# EAGLE design esp8266Remote (EAGLE 9.5.2)
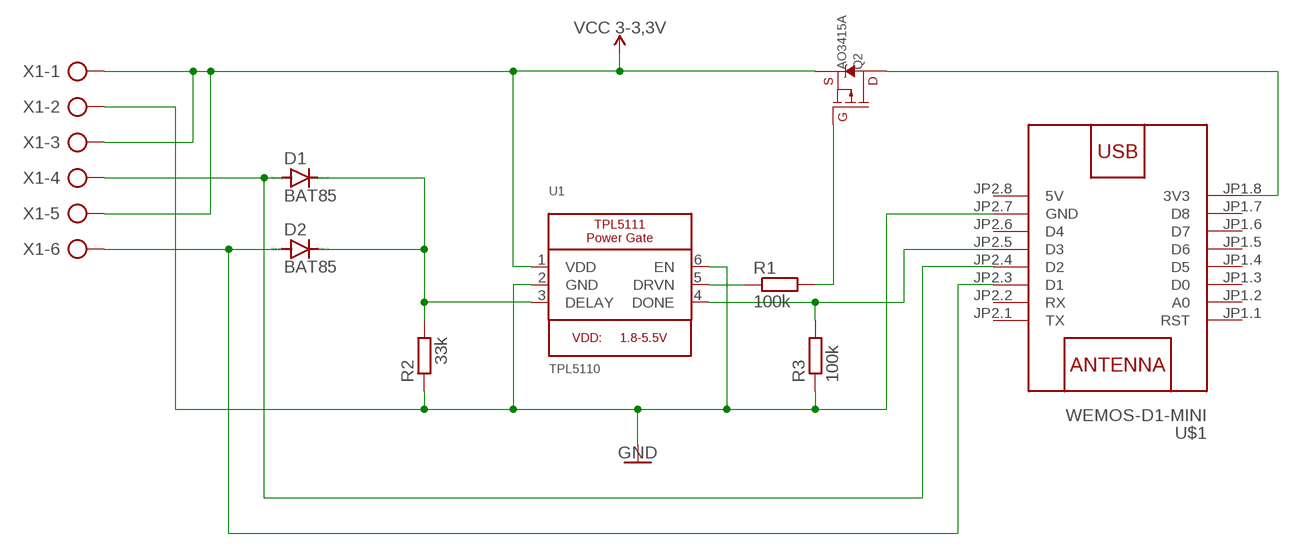
[diagram p0: schematic, sheet 1]

## Parts
D1  BAT85  DIODE-D-5  [D-5]
D2  BAT85  DIODE-D-5  [D-5]
Q2  AO3415A  MOSFET_PCHDIL3-SOT23-3-ADPATER  [HDRV3W64P254_1X3_1016X400X838B]
R1  100k  R-EU_0207/12  [0207/12]
R2  33k  R-EU_0204/5  [0204/5]
R3  100k  R-EU_0204/5  [0204/5]
U1  TPL5110  TPL5111DIL-6-ADAPTER  [DIP762W53P254L866H300Q6B]
U$1  WEMOS-D1-MINI  [WEMOS-D1-MINI]
X1  AK500/6  [AK500/6]

## Nets
GND: R2.1 R3.1 U1.2(GND) U1.6(EN) U$1.JP2.7(GND) X1.2
N$1: D2.A U$1.JP2.3(D1) X1.6
N$2: Q2.2(D) U$1.JP1.8(3V3)
N$3: R1.1 U1.5(DRVN)
N$4: Q2.3(G) R1.2
N$5: D1.A U$1.JP2.4(D2) X1.4
N$6: R3.2 U1.4(DONE) U$1.JP2.5(D3)
N$7: D1.C D2.C R2.2 U1.3(DELAY)
VCC: Q2.1(S) U1.1(VDD) X1.1 X1.3 X1.5 ; supply symbol labelled VCC 3-3,3V
Unconnected: U$1.JP1.1(RST) U$1.JP1.2(A0) U$1.JP1.3(D0) U$1.JP1.4(D5) U$1.JP1.5(D6) U$1.JP1.6(D7) U$1.JP1.7(D8) U$1.JP2.1(TX) U$1.JP2.2(RX) U$1.JP2.6(D4)

## Power pins joined to a net without a drawn wire
5V: U$1.JP2.8(5V)

## Library data of the parts
D1 D2 = diode:DIODE-: DIODE
Q2 = rene-custom:MOSFET_PCH: P-channel MOSFETs Voltage controlled devices that allow control of high current outputs. SparkFun Products: SparkFun ESP32 Thing <https://www.sparkfun.com/products/13907> SparkFun ESP8266 Thing <https://www.sparkfun.com/products/13231> SparkFun Pi Servo HAT V2 <https://www.sparkfun.com/products/15316> DMG2305UX-7 (20V/4.2A/SOT23-3)
R1-R3 = rcl:R-EU_: RESISTOR, European symbol; SPICEPREFIX: R
U1 = rene-custom:TPL5111: TPL5111 Timer Based Power Gate Selectable Time Intervals: 100 ms to 7200 s Current Consumption at 2.5 V: 35 nA (typical) Supply Voltage Range: 1.8 V to 5.5 V
U$1 = diy-modules:WEMOS-D1-MINI: WEMOS D1 mini: Mini Wi-Fi Board based on ESP-8266 device More details can be found here: https://www.wemos.cc/product/d1-mini.html Click here to find device on ebay.com <http://www.ebay.com/sch/wemos+d1+mini+nodemcu>
X1 = con-ptr500:AK500/6: CONNECTOR; OC_FARNELL: unknown; OC_NEWARK: unknown

## Board
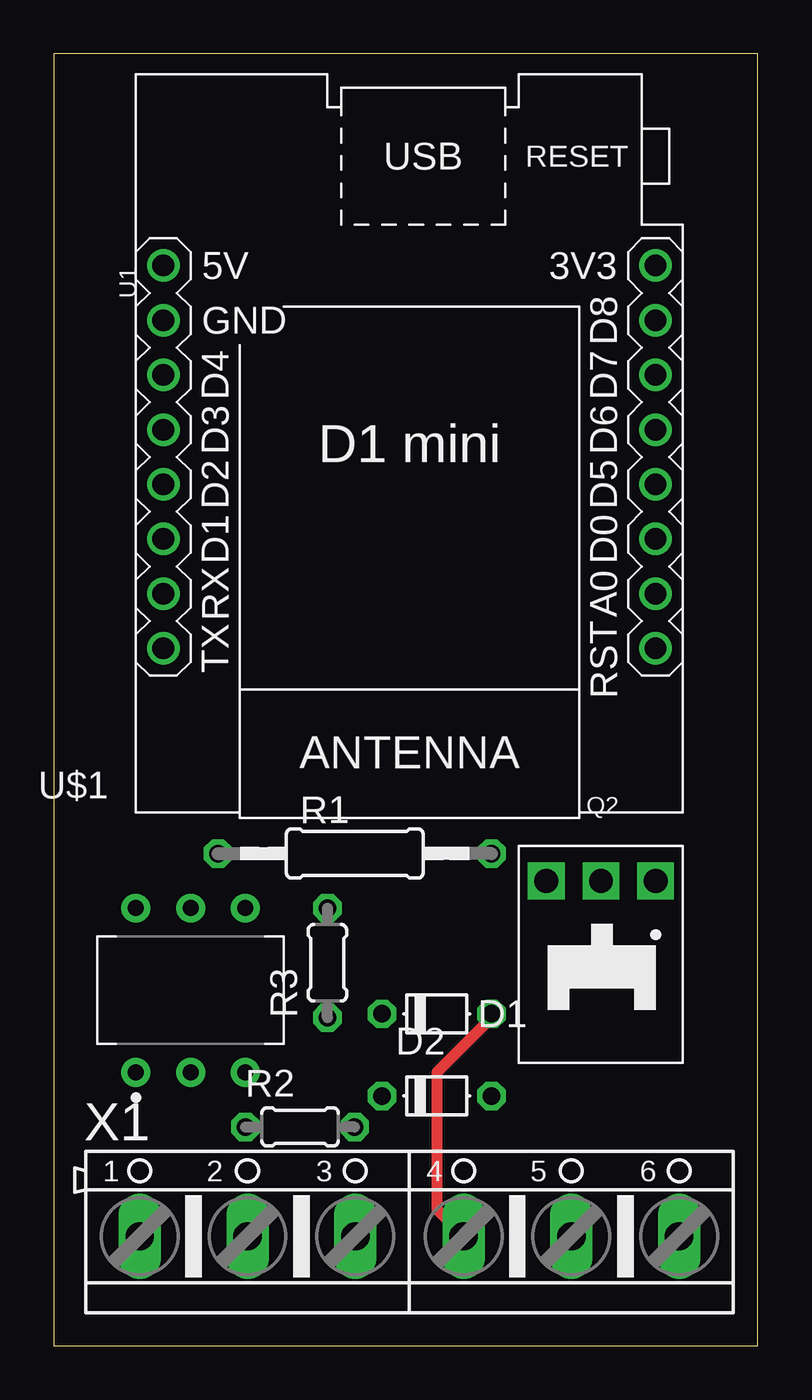
[diagram p1: board, top side]
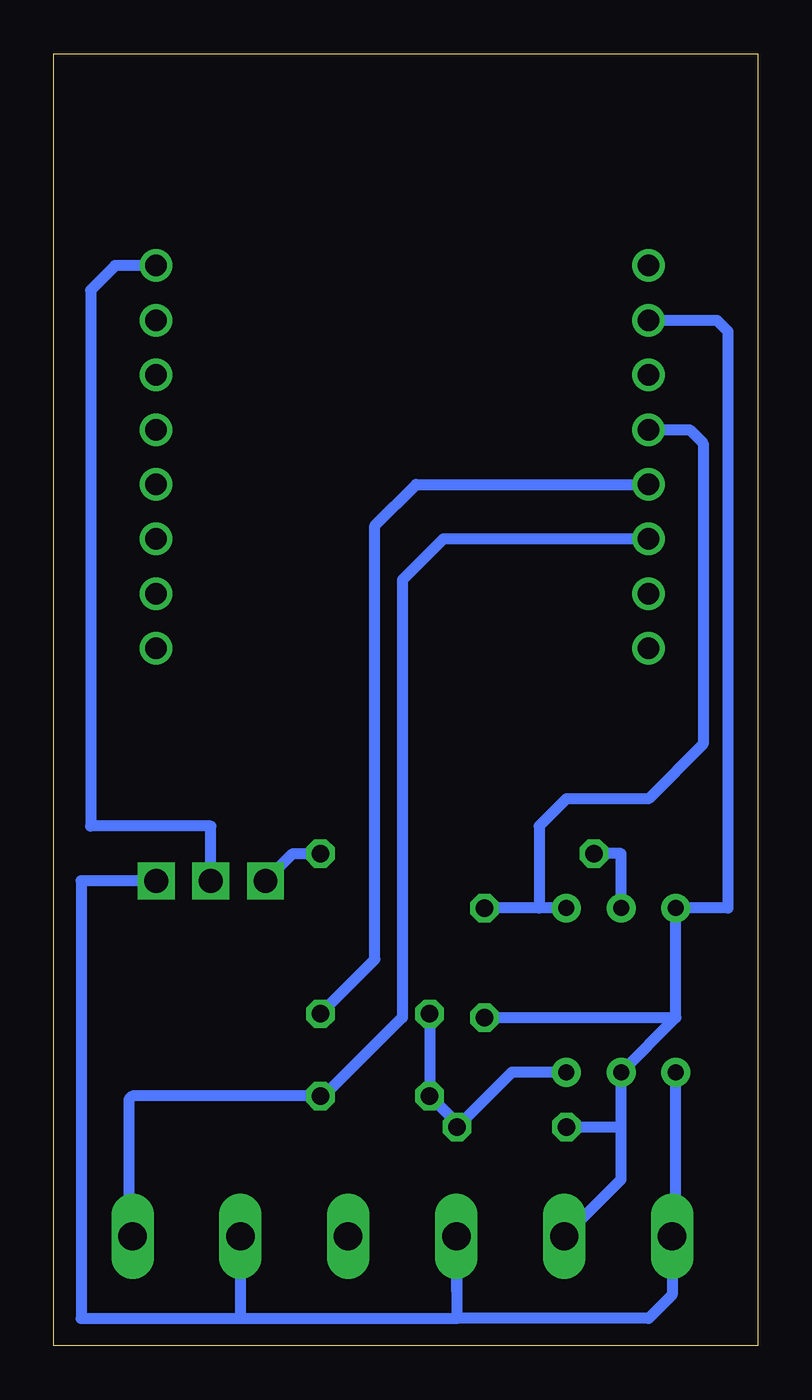
[diagram p2: board, bottom side, seen from below]

Size 32.69 x 60 mm. Coordinates in mm from the lower left corner, seen from the top.
Outline: 0,0 32.69,0 32.69,60 0,60 0,0
Copper layers (1*16): Top 0.035mm / dielectric 1.5mm / Bottom 0.035mm
Design rules "default": minimum track width 6mil, minimum drill 0.35mm, track to track 6mil, track to pad 6mil, pad to pad 6mil, via to via 6mil, smd to smd 6mil, copper to edge 40mil, drill to drill 6mil, minimum pad ring 10mil, minimum via ring 8mil, stop-mask expansion 4mil, vias tented up to drill 0mil, thermal gap 10mil

### Footprints (pad centres in the part's own frame; a part is rotated, then mirrored left to right if it is on the bottom)
D-5 = drill 0.813 octagon: A 2.54,0; C -2.54,0
HDRV3W64P254_1X3_1016X400X838B = drill 1.105 pad 1.705 square: 1 0,0; 2 2.54,0; 3 5.08,0
0207/12 = drill 0.813 octagon: 1 -6.35,0; 2 6.35,0
0204/5 = drill 0.813 octagon: 1 -2.54,0; 2 2.54,0
DIP762W53P254L866H300Q6B = drill 0.743 pad 1.343: 1 -3.81,2.54; 2 -3.81,0; 3 -3.81,-2.54; 4 3.81,-2.54; 5 3.81,0; 6 3.81,2.54
WEMOS-D1-MINI = drill 1: JP1.1 -11.43,9.525; JP1.2 -11.43,6.985; JP1.3 -11.43,4.445; JP1.4 -11.43,1.905; JP1.5 -11.43,-0.635; JP1.6 -11.43,-3.175; JP1.7 -11.43,-5.715; JP1.8 -11.43,-8.255; JP2.1 11.43,9.525; JP2.2 11.43,6.985; JP2.3 11.43,4.445; JP2.4 11.43,1.905; JP2.5 11.43,-0.635; JP2.6 11.43,-3.175; JP2.7 11.43,-5.715; JP2.8 11.43,-8.255
AK500/6 = drill 1.321 long: 1 -12.522,0; 2 -7.518,0; 3 -2.515,0; 4 2.515,0; 5 7.518,0; 6 12.522,0

### Placement (x,y rotation side)
D1  17.78,15.41 0 top
D2  17.78,11.6 0 top
Q2  27.94,21.59 180 top
R1  13.97,22.86 0 top
R2  11.43,10.16 0 top
R3  12.7,17.78 90 top
U1  6.35,16.51 90 top
U$1  16.51,41.91 180 top
X1  16.51,5.08 0 top

### Tracks (layer width: path | path; a pad name or v marks a point on that pad's centre or on a via)
GND
  Bottom 0.508: X1.2 6.35,7.72 6.35,10.16 | 6.35,10.16 U1.2 3.81,15.24 | 3.81,15.24 U1.6 1.4,20.32 1.4,47.12 1.91,47.62 U$1.JP2.7 | R2.1 6.35,10.16 | R3.1 3.81,15.24
N$1
  Bottom 0.508: X1.6 29.21,5.26 29.21,11.43 29.04,11.6 D2.A 20.15,11.6 16.51,15.24 16.51,35.56 14.61,37.47 U$1.JP2.3
N$2
  Bottom 0.508: U$1.JP1.8 29.84,50.16 30.99,49.02 30.99,24.13 25.4,24.13 Q2.2
N$3
  Bottom 0.508: U1.5 6.35,22.86 R1.1
N$4
  Bottom 0.508: Q2.3 21.59,22.86 R1.2
N$5
  Top 0.508: D1.A 20.32,15.24 17.78,12.7 17.78,6.33 X1.4
  Bottom 0.508: D1.A 17.78,17.95 17.78,38.1 15.88,40.01 U$1.JP2.4
N$6
  Bottom 0.508: U1.4 10.16,20.32 | 10.16,20.32 R3.2 | U$1.JP2.5 3.17,42.55 2.54,41.91 2.54,27.94 5.08,25.4 8.89,25.4 10.16,24.13 10.16,20.32
N$7
  Bottom 0.508: U1.3 11.43,12.7 R2.2 13.97,10.33 D2.C D1.C
VCC
  Bottom 0.508: 13.97,1.27 5.08,1.27 3.99,2.36 X1.1 3.81,5.26 U1.1 | 13.97,1.27 13.97,2.54 | 13.97,2.54 13.97,3.81 | X1.5 24.03,1.37 24.13,1.27 | 24.13,1.27 13.97,1.27 | Q2.1 31.42,21.59 31.42,1.27 24.13,1.27 | X1.3 13.99,2.56 13.97,2.54